# Altium project ppg.PrjPcb
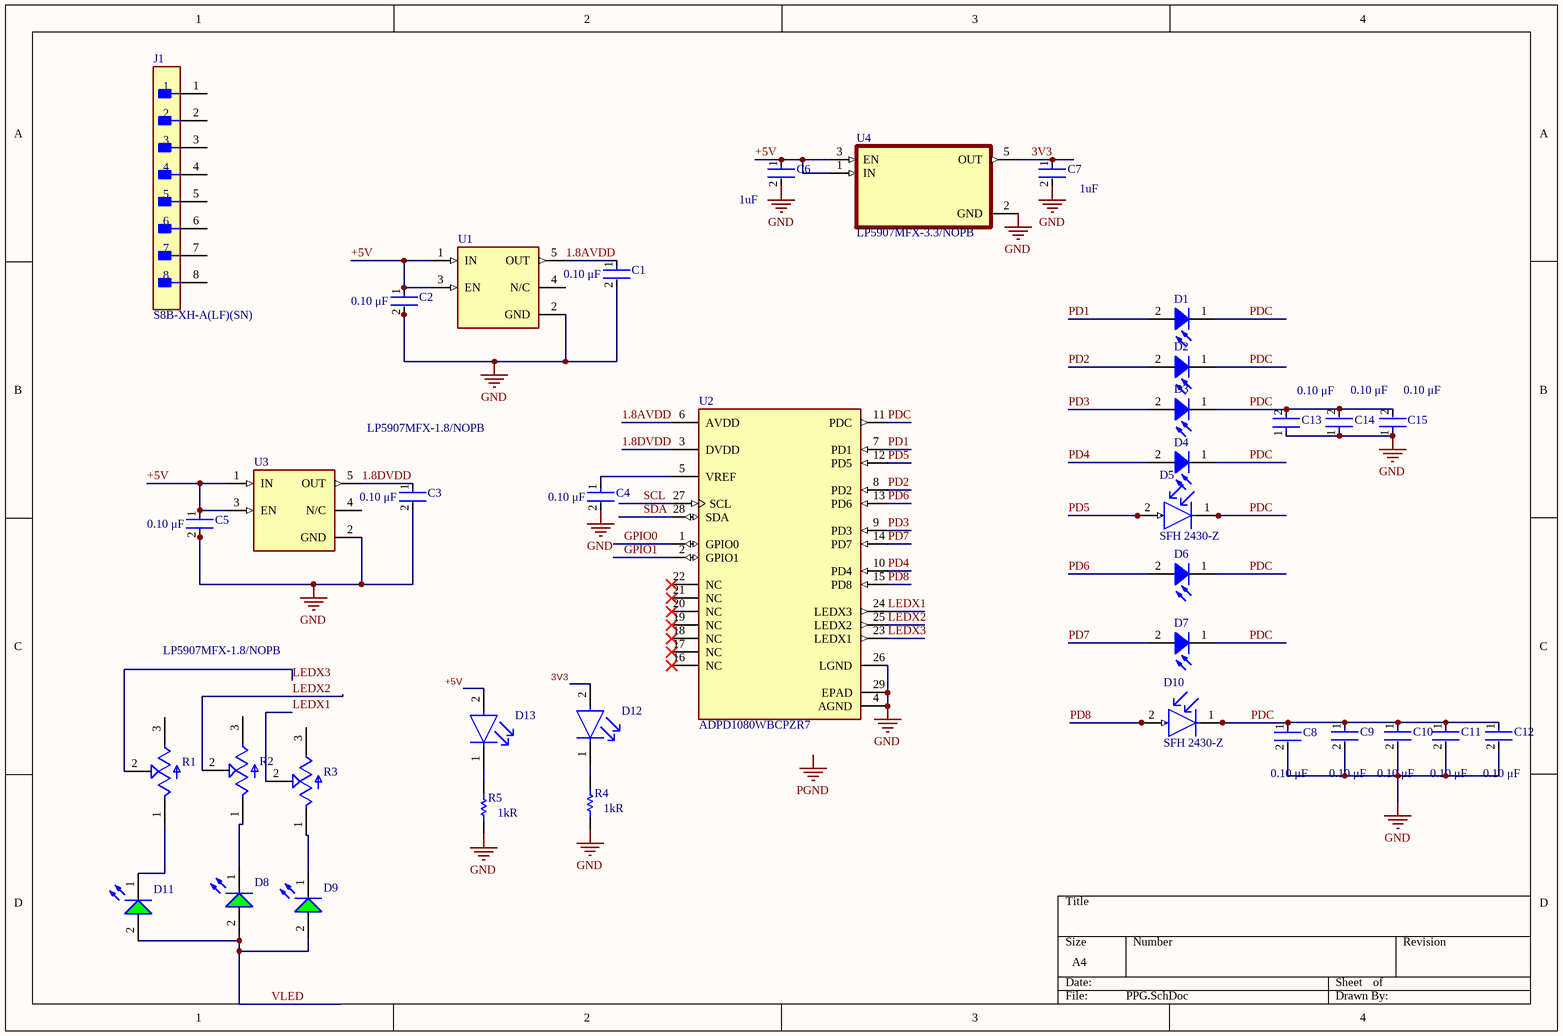
[diagram p0: PPG.SchDoc]
1 sheet, 38 parts. Net scope: global (net labels, ports and power ports of the same name join across sheets).
Board file: PPG.PcbDoc

## Sheet PPG.SchDoc
size A4; SheetNumber: 1; SheetTotal: 1; SPICEModelCacheSGABUIPG: <root> / <DocumentId>SGABUIPG</DocumentId> / <CacheFrame Number="0"> / <Model Name="emk107b7105_a-t" Kind="CKT"> / <Text>* EMK107B7105_A-T     SPICE MODEL  ( General Type ) / *-------------------------------------------------------------------------------------------------------- / * Model Generated by TAIYO YUDEN Corporation (http://www.ty-top.com) / * Version 1.0 / * TAIYO YUDEN Control No. 170508_100817 / * Copyright(c) 2012 TAIYO YUDEN CO.,LTD. All Rights Reserved. / *-------------------------------------------------------------------------------------------------------- / * / * Products Name : Multilayer Ceramic Capacitors / * / * Characteristics : / *     Capacitance : 1 uF , Rated Voltage : 16V , TCC : X7R / *     Case Size : 1.6 x 0.8 / 0.063 x 0.031 [mm/inch] , Thickness : 0.8 / 0.031 [mm/inch] / *     (Conditions: Temperature = 25 degC , DC Bias Current/Voltage = 0A / 0V) / * / * Frequency Range : 40Hz - 3GHz / * / * External Node Assignments : / * / *  1  o---| |---o  2 / * / *-------------------------------------------------------------------------------------------------------- / .SubCkt EMK107B7105_A-T 1 2 / **************************** / C0 1 110 0.90108u / Cm 1 101 0.070545u / C1 101 102 0.18914u / Rc1 101 102 4.3021k / C2 102 103 0.067165u / Rc2 102 103 569.84 / C3 103 110 0.028298u / Rc3 103 110 28.506 / C2m 1 301 0.078621u / C21 301 302 0.41782u / Rc21 301 302 10.613k / C22 302 303 0.38277u / Rc22 302 303 9.5065k / C23 303 304 0.47946u / Rc23 303 304 7.4363k / C24 304 305 0.19696u / Rc24 304 305 877.74 / C25 305 306 0.21015u / Rc25 305 306 755.27 / C26 306 307 0.054853u / Rc26 306 307 98.071 / C27 307 308 0.094721u / Rc27 307 308 50.335 / C28 308 309 0.053445u / Rc28 308 309 88.667 / C29 309 110 951.93p / Rc29 309 110 21.6 / Rp0 1 110 100Meg / L0 110 120 0.31208n / Lm 120 130 0.14711n / L1 120 121 0.11343n / RL1 121 130 0.23291 / L2 120 122 0.12254n / RL2 122 130 0.15461 / L3 120 123 0.22819n / RL3 123 130 0.26571 / CR 120 124 0.16707u / LR 124 125 0.23194n / RR 125 130 39.005m / CL 130 140 2.2074p / LL 130 140 0.16837n / RL 130 140 33.851 / Rs 140 2 5.452m / **************************** / .ends EMK107B7105_A-T</Text> / </Model> / </CacheFrame> / </root>

### Parts
C1  Capacitance: 0.10 μF  [FP-C0402-BB-MFG]  (hidden comment: C0402C104K3RACTU)
C2  Capacitance: 0.10 μF  [FP-C0402-BB-MFG]  (hidden comment: C0402C104K3RACTU)
C3  Capacitance: 0.10 μF  [FP-C0402-BB-MFG]  (hidden comment: C0402C104K3RACTU)
C4  Capacitance: 0.10 μF  [FP-C0402-BB-MFG]  (hidden comment: C0402C104K3RACTU)
C5  Capacitance: 0.10 μF  [FP-C0402-BB-MFG]  (hidden comment: C0402C104K3RACTU)
C6  value 1uF  [FP-0603-L_1_6_0_1-W_0_8_0-IPC_C]  (hidden comment: EMK107B7105KA-T)
C7  value 1uF  [FP-0603-L_1_6_0_1-W_0_8_0-IPC_C]  (hidden comment: EMK107B7105KA-T)
C8  Capacitance: 0.10 μF  [FP-C0402-BB-MFG]  (hidden comment: C0402C104K3RACTU)
C9  Capacitance: 0.10 μF  [FP-C0402-BB-MFG]  (hidden comment: C0402C104K3RACTU)
C10  Capacitance: 0.10 μF  [FP-C0402-BB-MFG]  (hidden comment: C0402C104K3RACTU)
C11  Capacitance: 0.10 μF  [FP-C0402-BB-MFG]  (hidden comment: C0402C104K3RACTU)
C12  Capacitance: 0.10 μF  [FP-C0402-BB-MFG]  (hidden comment: C0402C104K3RACTU)
C13  Capacitance: 0.10 μF  [FP-C0402-BB-MFG]  (hidden comment: C0402C104K3RACTU)
C14  Capacitance: 0.10 μF  [FP-C0402-BB-MFG]  (hidden comment: C0402C104K3RACTU)
C15  Capacitance: 0.10 μF  [FP-C0402-BB-MFG]  (hidden comment: C0402C104K3RACTU)
D1  1541201EEA400  [WL-SDCB_1206]  (value not drawn)
D2  1541201EEA400  [WL-SDCB_1206]  (value not drawn)
D3  1541201EEA400  [WL-SDCB_1206]  (value not drawn)
D4  1541201EEA400  [WL-SDCB_1206]  (value not drawn)
D5  SFH 2430-Z  [FP-SFH_2430-MFG]
D6  1541201EEA400  [WL-SDCB_1206]  (value not drawn)
D7  1541201EEA400  [WL-SDCB_1206]  (value not drawn)
D8  150141GS73100  [WL-SMTW_3528]  (value not drawn)
D9  150141GS73100  [WL-SMTW_3528]  (value not drawn)
D10  SFH 2430-Z  [FP-SFH_2430-MFG]
D11  150141GS73100  [WL-SMTW_3528]  (value not drawn)
D12  LTST-S270KRKT  [FP-LTST-S270KRKT-MFG]  (value not drawn)
D13  LTST-S270KRKT  [FP-LTST-S270KRKT-MFG]  (value not drawn)
J1  S8B-XH-A(LF)(SN)  [S8B-XH-A]
R1  TC33X-2-103E  [TC33X-2-103E]  (value not drawn)
R2  TC33X-2-103E  [TC33X-2-103E]  (value not drawn)
R3  TC33X-2-103E  [TC33X-2-103E]  (value not drawn)
R4  value 1kR  [RESC1005X40X25LL10T10]  (hidden comment: RK73H1ETTP1001F)
R5  value 1kR  [RESC1005X40X25LL10T10]  (hidden comment: RK73H1ETTP1001F)
U1  LP5907MFX-1.8/NOPB  [LP5907MFX-1.8/NOPB]
U2  ADPD1080WBCPZR7  [ADPD1080WBCPZR7]
U3  LP5907MFX-1.8/NOPB  [LP5907MFX-1.8/NOPB]
U4  LP5907MFX-3.3/NOPB  [296-38557-1-ND]

### Nets
GND: C1.2 C2.2 C3.2 C4.2 C5.2 C6.2 C7.2 C8.2 C9.2 C10.2 C11.2 C12.2 C13.1 C14.1 C15.1 R4.1 R5.1 U1.2(GND) U2.4(AGND) U2.26(LGND) U2.29(EPAD) U3.2(GND) U4.2(GND)
1.8AVDD: C1.1 U1.5(OUT) U2.6(AVDD)
1.8DVDD: C3.1 U2.3(DVDD) U3.5(OUT)
3V3: C7.1 D12.2(A) U4.5(OUT)
+5V: C2.1 C5.1 C6.1 D13.2(A) U1.1(IN) U1.3(EN) U3.1(IN) U3.3(EN) U4.1(IN) U4.3(EN)
GPIO0: U2.1(GPIO0)
GPIO1: U2.2(GPIO1)
LEDX1: R3.2(W) U2.24(LEDX3)
LEDX2: R2.2(W) U2.25(LEDX2)
LEDX3: R1.2(W) U2.23(LEDX1)
PD1: D1.2(A) U2.7(PD1)
PD2: D2.2(A) U2.8(PD2)
PD3: D3.2(A) U2.9(PD3)
PD4: D4.2(A) U2.10(PD4)
PD5: D5.2(A) U2.12(PD5)
PD6: D6.2(A) U2.13(PD6)
PD7: D7.2(A) U2.14(PD7)
PD8: D10.2(A) U2.15(PD8)
PDC: C8.1 C9.1 C10.1 C11.1 C12.1 C13.2 C14.2 C15.2 D1.1(K) D2.1(K) D3.1(K) D4.1(K) D5.1(C) D6.1(K) D7.1(K) D10.1(C) U2.11(PDC)
SCL: U2.27(SCL)
SDA: U2.28(SDA)
VLED: D8.2(A) D9.2(A) D11.2(A)
NetC4_1: C4.1 U2.5(VREF)
NetD8_1: D8.1(K) R2.1(CCW)
NetD9_1: D9.1(K) R3.1(CCW)
NetD11_1: D11.1(K) R1.1(CCW)
NetD12_1: D12.1(C) R4.2
NetD13_1: D13.1(C) R5.2

Not connected (* = marked no-connect by the designer): J1 1 2 3 4 5 6 7 8; R1 3(CW); R2 3(CW); R3 3(CW); U1 4(N/C); U2 16(NC)* 17(NC)* 18(NC)* 19(NC)* 20(NC)* 21(NC)* 22(NC)*; U3 4(N/C)

### Notes on the sheet
- Labels drawn without touching a wire or pin: PGND

### Library data of the parts
C1-C5 C8-C15 = CMP-03020-012858-1: Cap Ceramic 0.1uF 25V X7R 10% Pad SMD 0402 125C T/R; Manufacturer: Kemet; Value: 0.10 μF; Temperature Coefficient: 15%; Tolerance: 0.1; Dielectric Material: 4241ConductorMaterial; Temperature: -55°C to +125°C; Automotive: No; Height: 0.55mm; Package: C0402-BB; Category: Cap; Temperature Range Low: -55°C; Manufacturer Part Number: C0402C104K3RACTU; Device Class L2: Capacitors; Temperature Characteristic: X7R; Lead Free: Yes; Material: Ceramic; Mouser Description: Cap Ceramic 0.1uF 25V X7R 10% Pad SMD 0402 125C T/R; Temperature Range High: +125°C; Digikey Description: Cap Ceramic 0.1uF 25V X7R 10% Pad SMD 0402 125C T/R; Ipc Land Pattern Name: CAPC10050X50; Voltage Rating: 25 V; ComponentLink2URL: https://content.kemet.com/datasheets/KEM_C1002_X7R_SMD.pdf; Device Class L3: Ceramic Capacitors; RoHS: TRUE; Device Class L1: Passive Components; Octopart: https://octopart.com/c0402c104k3ractu-kemet-71105629; ComponentLink2Description: Datasheet; Supplier: Digikey; Supplier Part Number: 399-14148-1-ND; Stock: 453452; Pricing: 1=0.16, 10=0.095, 100=0.0611, 1000=0.04279, 2500=0.03794, 5000=0.0349 (USD); Case/Package: 0402; Pins: 2NUMBER; Case Code (Metric): 1005; Case Code (Imperial): 0402; Min Operating Temperature: -55°C; Max Operating Temperature: 125°C; Dielectric: X7R; Packaging: Cut Tape; Voltage Rating (DC): 25V; Reach SVHC Compliant: No; RoHS Compliant: Yes; ComponentLink1URL: http://www.farnell.com/datasheets/2746129.pdf?src-supplier=Farnell; ComponentLink1Description: http://www.farnell.com/datasheets/2746129.pdf?src-supplier=Farnell; ComponentLink3URL: http://www.farnell.com/datasheets/2746129.pdf?src-supplier=Newark; ComponentLink3Description: http://www.farnell.com/datasheets/2746129.pdf?src-supplier=Newark; ComponentLink4URL: http://www.farnell.com/datasheets/2746129.pdf?src-supplier=Element14; ComponentLink4Description: http://www.farnell.com/datasheets/2746129.pdf?src-supplier=Element14; ComponentLink5URL: https://datasheet.octopart.com/C0402C104K3RACTU-Kemet-datasheet-62095741.pdf?src-supplier=Element14; ComponentLink5Description: https://datasheet.octopart.com/C0402C104K3RACTU-Kemet-datasheet-62095741.pdf?src-supplier=Element14; ComponentLink6URL: https://api.kemet.com/component-edge/download/datasheet/C0402C104K3RAC7867.pdf?src-supplier=Digikey; ComponentLink6Description: https://api.kemet.com/component-edge/download/datasheet/C0402C104K3RAC7867.pdf?src-supplier=Digikey; ComponentLink7URL: https://datasheet.octopart.com/C0402C104K3RACTU-KEMET-datasheet-176289272.pdf?src-supplier=Newark; ComponentLink7Description: https://datasheet.octopart.com/C0402C104K3RACTU-KEMET-datasheet-176289272.pdf?src-supplier=Newark; ComponentLink8URL: https://datasheet.octopart.com/C0402C104K3RACTU-KEMET-datasheet-157246124.pdf?src-supplier=Electro+Sonic; ComponentLink8Description: https://datasheet.octopart.com/C0402C104K3RACTU-KEMET-datasheet-157246124.pdf?src-supplier=Electro+Sonic
C6 C7 = CMP-14477-000018-3: None; Manufacturer: Taiyo Yuden; Voltage Rating (DC): 16V; Dielectric: X7R; Tolerance: 10%; Material: 4241ConductorMaterial; Halogen Free: Halogen Free; Height: 0.8mm; REACH SVHC: No SVHC; Contact Plating: Nickel; Number of Pins: 2; Resistor Type: Ceramic; Series: M; Thickness: 0.035inch; Construction: Flat; Voltage Rating: 16V; Capacitance: 1uF; Packaging: Tape and Reel; Width: 0.031inch; Length: 1.6mm; Case Code (Metric): 1608; RoHS Compliant: Yes; Termination: SMD/SMT; Min Operating Temperature: -55°C; Case/Package: 0603; Mount: Surface Mount; Case Code (Imperial): 0603; Depth: 0.8mm; Package Quantity: 1; Max Operating Temperature: 125°C; Lead Free: Lead Free; Radiation Hardening: No; Supplier: Digikey; Supplier Part Number: 587-1241-1-ND; Manufacturer Part Number: EMK107B7105KA-T; RoHS: Yes; Category: Ceramic Capacitors; Stock: 1580663; Pricing: 1=0.08, 10=0.027, 50=0.022, 100=0.0168, 500=0.0152, 1000=0.0136 (USD); Mounting Technology: Surface Mount; Pins: 2; Reach SVHC Compliant: No; ComponentLink1URL: https://datasheet.ciiva.com/5815/1697718-5815968.pdf?src-supplier=Farnell; ComponentLink1Description: https://datasheet.ciiva.com/5815/1697718-5815968.pdf?src-supplier=Farnell; ComponentLink2URL: https://datasheet.ciiva.com/30212/193emk107b7105ka-t-30212019.pdf?src-supplier=Onlinecomponents.com; ComponentLink2Description: https://datasheet.ciiva.com/30212/193emk107b7105ka-t-30212019.pdf?src-supplier=Onlinecomponents.com; ComponentLink3URL: https://datasheet.ciiva.com/15920/966emk107b7105ka-t-15920470.pdf?src-supplier=Onlinecomponents.com; ComponentLink3Description: https://datasheet.ciiva.com/15920/966emk107b7105ka-t-15920470.pdf?src-supplier=Onlinecomponents.com; ComponentLink4URL: https://datasheet.ciiva.com/30137/126emk107b7105ka-t-30137199.pdf?src-supplier=Onlinecomponents.com; ComponentLink4Description: https://datasheet.ciiva.com/30137/126emk107b7105ka-t-30137199.pdf?src-supplier=Onlinecomponents.com; ComponentLink5URL: https://datasheet.ciiva.com/132/emk107b7105ka-t-ss-132544.pdf?src-supplier=Digikey; ComponentLink5Description: https://datasheet.ciiva.com/132/emk107b7105ka-t-ss-132544.pdf?src-supplier=Digikey; ComponentLink6URL: https://datasheet.ciiva.com/26871/getdatasheetpartid-637486-26871306.pdf?src-supplier=Verical; ComponentLink6Description: https://datasheet.ciiva.com/26871/getdatasheetpartid-637486-26871306.pdf?src-supplier=Verical; ComponentLink7URL: https://datasheet.ciiva.com/7657/1697718-7657322.pdf?src-supplier=Element14; ComponentLink7Description: https://datasheet.ciiva.com/7657/1697718-7657322.pdf?src-supplier=Element14; ComponentLink8URL: https://datasheet.ciiva.com/7975/746258-7975612.pdf?src-supplier=Element14; ComponentLink8Description: https://datasheet.ciiva.com/7975/746258-7975612.pdf?src-supplier=Element14
D1-D4 D6 D7 = CMP-03913-98687787-1: 1541201EEA400 WL-SDCB SMT Photodiode Chip Black; Manufacturer: Wurth Electronics; Max Reverse Voltage (DC): 32V; Viewing Angle: 140°; Height: 1.1mm; Width: 1.6mm; Length: 3.2mm; Min Operating Temperature: -40°C; RoHS: Compliant; Max Operating Temperature: 85°C; NexarPartId: 98687787; Supplier: Digikey; Supplier Part Number: 732-13405-1-ND; Manufacturer Part Number: 1541201EEA400; Category: Uncategorized; Stock: 2294; Pricing: 1=0.54, 10=0.463, 50=0.4068, 250=0.36452, 500=0.3276 (USD); ComponentLink1URL: https://www.we-online.com/catalog/datasheet/1541201EEA400.pdf?src-supplier=Digikey; ComponentLink1Description: https://www.we-online.com/catalog/datasheet/1541201EEA400.pdf?src-supplier=Digikey
D5 D10 = CMP-62027-000004-1: SENSOR PHOTODIODE 570NM 2SMD GW; Response Time: 200us; Max Power Dissipation: 150mW; Forward Voltage: 1.2V; Viewing Angle: 120°; Dark Current: 100pA; Reverse Voltage (DC): 6V; Diode Type: PIN; Forward Current: 100mA; Case/Package: SMD/SMT; Width: 4mm; Min Operating Temperature: -40°C; Mount: Surface Mount; Package Quantity: 1500; Packaging: Tape and Reel; Radiation Hardening: No; Wavelength: 570nm; Max Operating Temperature: 100°C; Fall Time: 200us; Length: 4.5mm; Rise Time: 200us; Height: 1.2mm; Max Reverse Voltage (DC): 6V; Number of Pins: 2
D8 D9 D11 = CMP-1429-00004-2: NexarPartId: 29717794; Manufacturer: Wurth Electronics; Forward Current: 100mA; Lens Style: Clear, Round; Color: Green; Wavelength: 525nm; Peak Wavelength: 515nm; Luminous Intensity: 1cd; Forward Voltage: 3.1V; Viewing Angle: 120°; Test Current: 20mA; Max Reverse Voltage (DC): 5V; Power Dissipation: 105mW; Lens Color: Colorless; Lens Transparency: Clear; Lens Size: 2.4mm; Mount: Surface Mount; Max Operating Temperature: 85°C; Min Operating Temperature: -40°C; Lead Free: Lead Free; Width: 2.8mm; Case Code (Imperial): 1411; REACH SVHC: Unknown; RoHS: Compliant; Packaging: Tape and Reel; Length: 3.5mm; Dominant Wavelength: 525nm; Height: 1.9mm; Case/Package: 3528; Reverse Voltage: 5V; Case Code (Metric): 3528; Supplier: Digikey; Supplier Part Number: 732-4997-1-ND; Manufacturer Part Number: 150141GS73100; Category: LEDs; Stock: 36143; Pricing: 1=0.17, 50=0.1684, 100=0.1467, 500=0.115 (USD); Mounting Technology: Surface Mount; Package Quantity: 1; Series: WL-SMTW; RoHS Compliant: Yes; Reach SVHC Compliant: Unknown; ComponentLink1URL: https://datasheet.ciiva.com/23843/150141gs73100-23843266.pdf?src-supplier=Newark; ComponentLink1Description: https://datasheet.ciiva.com/23843/150141gs73100-23843266.pdf?src-supplier=Newark; ComponentLink2URL: https://datasheet.ciiva.com/29278/759463-da-01-en-smd-topled-einf-gruen-150141gs73100-29278953.pdf?src-supplier=Conrad; ComponentLink2Description: https://datasheet.ciiva.com/29278/759463-da-01-en-smd-topled-einf-gruen-150141gs73100-29278953.pdf?src-supplier=Conrad; ComponentLink3URL: https://datasheet.ciiva.com/22656/1911484-22656997.pdf?src-supplier=Element14; ComponentLink3Description: https://datasheet.ciiva.com/22656/1911484-22656997.pdf?src-supplier=Element14; ComponentLink4URL: https://datasheet.ciiva.com/48430/150141gs73100-eng-tds-48430060.pdf?src-supplier=Distrelec; ComponentLink4Description: https://datasheet.ciiva.com/48430/150141gs73100-eng-tds-48430060.pdf?src-supplier=Distrelec; ComponentLink5URL: https://datasheet.ciiva.com/29563/150141gs73100-29563029.pdf?src-supplier=Digikey; ComponentLink5Description: https://datasheet.ciiva.com/29563/150141gs73100-29563029.pdf?src-supplier=Digikey; ComponentLink6URL: https://datasheet.ciiva.com/29563/150141gs73100-29563030.pdf?src-supplier=Digikey; ComponentLink6Description: https://datasheet.ciiva.com/29563/150141gs73100-29563030.pdf?src-supplier=Digikey
D12 D13 = CMP-2000-06630-2: LED RED CLEAR CHIP SMD R/A; Manufacturer: Vishay Lite-On; Test Current: 20mA; Number of LEDs: 1; Power Rating: 75mW; Lens Style: Diffused; Luminous Intensity: 54mcd; Wavelength: 639nm; Dominant Wavelength: 631nm; Lens Color: Colorless; Forward Voltage: 2V; Viewing Angle: 130°; Forward Current: 30mA; Reverse Voltage: 5V; Lens Size: 0.6mm; Illumination Color: Red; Case Code (Imperial): 0603; Color: Red; Packaging: Tape and Reel; Number of Pins: 2; Length: 1.6mm; Lens Transparency: Clear; Width: 1.15mm; Power Dissipation: 75mW; Lead Free: Lead Free; Max Power Dissipation: 75mW; Case/Package: 0603; Max Operating Temperature: 85°C; Mount: Surface Mount; Depth: 0.6mm; Number of Elements: 1; Radiation Hardening: No; Case Code (Metric): 1608; Package Quantity: 1; Height: 0.6mm; Min Operating Temperature: -55°C; Supplier: Digikey; Supplier Part Number: 160-1479-1-ND; Manufacturer Part Number: LTST-S270KRKT; RoHS: Yes; Category: LEDs; Stock: 83540; Pricing: 1=0.24, 10=0.133, 100=0.0617, 500=0.05696, 1000=0.04462, 2000=0.04367 (USD); Mounting Technology: Surface Mount; Pins: 2; Series: -; RoHS Compliant: Yes; ComponentLink1URL: https://datasheet.ciiva.com/11775/0900766b80dc0b8e-11775445.pdf?src-supplier=Rs; ComponentLink1Description: https://datasheet.ciiva.com/11775/0900766b80dc0b8e-11775445.pdf?src-supplier=Rs; ComponentLink2URL: https://datasheet.ciiva.com/12400/ltst-s270krkt-201849-12400833.pdf?src-supplier=Mouser; ComponentLink2Description: https://datasheet.ciiva.com/12400/ltst-s270krkt-201849-12400833.pdf?src-supplier=Mouser; ComponentLink3URL: https://datasheet.ciiva.com/2110/ltst-s270krkt-2110021.pdf?src-supplier=Digikey; ComponentLink3Description: https://datasheet.ciiva.com/2110/ltst-s270krkt-2110021.pdf?src-supplier=Digikey; ComponentLink4URL: https://datasheet.ciiva.com/16387/p-100-ltst-s270krkt-16387507.pdf?src-supplier=Future+Electronics; ComponentLink4Description: https://datasheet.ciiva.com/16387/p-100-ltst-s270krkt-16387507.pdf?src-supplier=Future+Electronics; ComponentLink5URL: https://datasheet.ciiva.com/2110/s-110-ltst-s270krkt-2110023.pdf?src-supplier=Digikey; ComponentLink5Description: https://datasheet.ciiva.com/2110/s-110-ltst-s270krkt-2110023.pdf?src-supplier=Digikey; ComponentLink6URL: https://datasheet.ciiva.com/2110/s-110-ltst-s270krkt-2110022.pdf?src-supplier=Digikey; ComponentLink6Description: https://datasheet.ciiva.com/2110/s-110-ltst-s270krkt-2110022.pdf?src-supplier=Digikey
J1 = S8B-XH-A(LF)(SN): Conn Shrouded Header (4 Sides) HDR 8 POS 2.5mm Solder RA Thru-Hole Box; Manufacturer: JST; Current Rating: 3A; Voltage Rating: 250V; Number of Positions: 8; Contact Resistance: 20mR; Supplier: Mouser; Supplier Part Number: 306-S8B-XH-ALFSN; Manufacturer Part Number: S8B-XH-A(LF)(SN); RoHS: Yes; Category: Headers and Wire Housings; Stock: 23372; Pricing: 1=0.31, 10=0.278, 50=0.278, 100=0.197, 1000=0.159, 10000=0.159 (USD); Mounting Technology: Through Hole; Contact Material: Brass; Contact Plating: Tin,Copper,Lead; Contact Shape: Square; Insulation Material: Nylon; Insulation Color: Natural; Contact Finish - Mating: TIN; Housing Color: White; Housing Material: Polyamide; Min Operating Temperature: -25°C; Max Operating Temperature: 85°C; Number of Rows: 1; Packaging: Bulk; Termination: Solder; Orientation: Right Angle; Connector Type: Header; Fastening Type: Detent; Series: XH; Contact Type: Male Pin; Max Current Rating: 3A; Number of Contacts: 8; Max Voltage Rating (AC): 250V; Length: 22.4mm; Pitch: 2.5mm; Depth: 11.5mm; Flammability Rating: UL94 V-0; Reach SVHC Compliant: No; ComponentLink1URL: https://datasheet.ciiva.com/26894/getdatasheetpartid-748678-26894649.pdf?src-supplier=Verical; ComponentLink1Description: https://datasheet.ciiva.com/26894/getdatasheetpartid-748678-26894649.pdf?src-supplier=Verical; ComponentLink2URL: https://datasheet.ciiva.com/726/exh-726382.pdf?src-supplier=Digikey; ComponentLink2Description: https://datasheet.ciiva.com/726/exh-726382.pdf?src-supplier=Digikey; ComponentLink3URL: https://datasheet.ciiva.com/16484/exh-16484633.pdf?src-supplier=Future+Electronics; ComponentLink3Description: https://datasheet.ciiva.com/16484/exh-16484633.pdf?src-supplier=Future+Electronics; Supplier 1: Mouser; Supplier Part Number 1: 306-S8B-XH-ALFSN
R1-R3 = TC33X-2-103E: Cermet trimmer potentiometer, 10 kΩ, 0.1 W, SMD, on top, TC33X-2-103E; Manufacturer: Bourns; Tolerance: 25%; Value: 10kR; Number of Turns: 1; Power Rating: 100mW; Temperature Coefficient: 250ppm/°C; Voltage Rating (DC): 50V; Supplier: Digikey; Supplier Part Number: TC33X-103ECT-ND; Manufacturer Part Number: TC33X-2-103E; RoHS: Yes; Category: Variable Resistors and Potentiometers; Stock: 58293; Pricing: 1=0.33, 10=0.267, 25=0.2448, 50=0.2292, 100=0.2147, 250=0.19668, 500=0.18402, 1000=0.17215 (USD); Mounting Technology: Surface Mount; Color: Silver; Weight: 29.4mg; Min Operating Temperature: -40°C; Max Operating Temperature: 100°C; Packaging: Tape and Reel; Package Quantity: 1; Resistor Type: Cermet; Termination: Foot Print; Taper: Linear; Max Power Dissipation: 100mW; Series: TC33; Resistance Tolerance: 25%; Length: 3mm; Width: 0.118inch; Height: 0.047inch; Depth: 3.8mm; Radiation Hardening: No; Reach SVHC Compliant: No; Military Standard: Not; Lead Free: Lead Free; RoHS Compliant: Yes; ComponentLink1URL: https://datasheet.ciiva.com/11830/0900766b802749b3-11830705.pdf?src-supplier=Rs; ComponentLink1Description: https://datasheet.ciiva.com/11830/0900766b802749b3-11830705.pdf?src-supplier=Rs; ComponentLink2URL: https://datasheet.ciiva.com/7953/1818686-7953349.pdf?src-supplier=Element14; ComponentLink2Description: https://datasheet.ciiva.com/7953/1818686-7953349.pdf?src-supplier=Element14; ComponentLink3URL: https://datasheet.ciiva.com/28659/1520225-28659212.pdf?src-supplier=Element14; ComponentLink3Description: https://datasheet.ciiva.com/28659/1520225-28659212.pdf?src-supplier=Element14; ComponentLink4URL: https://datasheet.ciiva.com/2155/tc33-2155963.pdf?src-supplier=Digikey; ComponentLink4Description: https://datasheet.ciiva.com/2155/tc33-2155963.pdf?src-supplier=Digikey; ComponentLink5URL: https://datasheet.ciiva.com/2155/tc33-2155964.pdf?src-supplier=Digikey; ComponentLink5Description: https://datasheet.ciiva.com/2155/tc33-2155964.pdf?src-supplier=Digikey; ComponentLink6URL: https://datasheet.ciiva.com/2155/tc33-2155962.pdf?src-supplier=Digikey; ComponentLink6Description: https://datasheet.ciiva.com/2155/tc33-2155962.pdf?src-supplier=Digikey; ComponentLink7URL: https://datasheet.ciiva.com/8089/tc33-8089484.pdf?src-supplier=Avnet; ComponentLink7Description: https://datasheet.ciiva.com/8089/tc33-8089484.pdf?src-supplier=Avnet; ComponentLink8URL: https://datasheet.ciiva.com/26944/getdatasheetpartid-183773-26944166.pdf?src-supplier=Verical; ComponentLink8Description: https://datasheet.ciiva.com/26944/getdatasheetpartid-183773-26944166.pdf?src-supplier=Verical; Supplier 1: Digikey; Supplier Part Number 1: TC33X-103ECT-ND
R4 R5 = CMP-2002-03808-1: Manufacturer: KOA Speer; Tolerance: 1%; Power Rating: 63mW; Voltage Rating: 50V; Temperature Coefficient: 100ppm/°C; Max Power Dissipation: 100mW; Part Number: RK73H1ETTP1001F; Supplier: Digikey; Supplier Part Number: 2019-RK73H1ETTP1001FCT-ND; Manufacturer Part Number: RK73H1ETTP1001F; RoHS: Yes; Category: Chip SMD Resistors; Stock: 1021606; Pricing: 1=0.1, 10=0.021, 50=0.0134, 100=0.0112, 500=0.00764, 1000=0.00658, 5000=0.00478 (USD); Mounting Technology: Surface Mount; Case/Package: 0402; Case Code (Imperial): 0402; Case Code (Metric): 1005; Min Operating Temperature: -55°C; Max Operating Temperature: 155°C; Packaging: Tape and Reel; Package Quantity: 10000; Termination: SMD/SMT; Series: RK73H; Construction: Rectangular; Technology: THICK FILM; Features: Moisture Resistant,Automotive AEC-Q200; Number of Terminations: 2; Voltage Rating (DC): 50V; Length: 1mm; Width: 0.5mm; Height: 0.35mm; Depth: 0.5mm; Ratings: AEC-Q200; Military Standard: Not; RoHS Compliant: Yes; Lead Free: 5697LeadFree; ComponentLink1URL: https://datasheet.ciiva.com/5554/rk73h-5554172.pdf?src-supplier=Mouser; ComponentLink1Description: https://datasheet.ciiva.com/5554/rk73h-5554172.pdf?src-supplier=Mouser
U1 U3 = LP5907MFX-1.8/NOPB: LDO Regulator Pos 1.8V 0.25A 5-Pin SOT-23 T/R; Manufacturer: Texas Instruments; Min Input Voltage: 2.2V; Number of Outputs: 1; Dropout Voltage: 250mV; Max Supply Voltage: 5.5V; Output Current: 250mA; Quiescent Current: 25uA; Power Supply Rejection Ratio (PSRR): 60dB; Output Type: Fixed; Output Configuration: Positive; Max Supply Current: 425uA; Supplier: Mouser; Supplier Part Number: 595-LP5907MFX-1.8NPB; Manufacturer Part Number: LP5907MFX-1.8/NOPB; RoHS: Yes; Category: Voltage Regulators - Linear; Stock: 22864; Pricing: 1=0.45, 10=0.277, 50=0.277, 100=0.229, 1000=0.212, 10000=0.197 (USD); Mounting Technology: Surface Mount; Case/Package: SOT-23-5; Pins: 5; Min Operating Temperature: -40°C; Max Operating Temperature: 125°C; Packaging: Tape and Reel; Package Quantity: 3000; Output Voltage: 1.8V; Number of Regulators: 1; Nominal Output Voltage: 1.8V; Series: -; Min Output Voltage: 1.8V; Reach SVHC Compliant: No; Lead Free: Lead Free; RoHS Compliant: Yes; ComponentLink1URL: https://media.digikey.com/pdf/Data%20Sheets/Texas%20Instruments%20PDFs/ConnectedSensorAutoSystemsGuide.pdf?src-supplier=Digikey; ComponentLink1Description: https://media.digikey.com/pdf/Data%20Sheets/Texas%20Instruments%20PDFs/ConnectedSensorAutoSystemsGuide.pdf?src-supplier=Digikey; ComponentLink2URL: http://www.ti.com/general/docs/lit/getliterature.tsp?genericPartNumber=LP5907&fileType=pdf&src-supplier=Farnell; ComponentLink2Description: http://www.ti.com/general/docs/lit/getliterature.tsp?genericPartNumber=LP5907&fileType=pdf&src-supplier=Farnell; ComponentLink3URL: http://www.ti.com/general/docs/lit/getliterature.tsp?genericPartNumber=LP5907&amp;&amp;fileType=pdf&src-supplier=Element14; ComponentLink3Description: http://www.ti.com/general/docs/lit/getliterature.tsp?genericPartNumber=LP5907&amp;&amp;fileType=pdf&src-supplier=Element14; ComponentLink4URL: http://www.ti.com/lit/pdf/szzy004?src-supplier=Digikey; ComponentLink4Description: http://www.ti.com/lit/pdf/szzy004?src-supplier=Digikey; ComponentLink5URL: http://www.ti.com/lit/gpn/lp5907?src-supplier=Mouser; ComponentLink5Description: http://www.ti.com/lit/gpn/lp5907?src-supplier=Mouser; ComponentLink6URL: http://www.ti.com/general/docs/lit/getliterature.tsp?genericPartNumber=LP5907&&fileType=pdf&src-supplier=Avnet; ComponentLink6Description: http://www.ti.com/general/docs/lit/getliterature.tsp?genericPartNumber=LP5907&&fileType=pdf&src-supplier=Avnet; Supplier 1: Digikey; Supplier Part Number 1: 296-41463-1-ND
U2 = ADPD1080WBCPZR7: Optical Afe For Health Monitorin; Supplier 1: Digikey; Supplier Part Number 1: 505-ADPD1080WBCPZR7CT-ND
U4 = LP5907MFX-3.3/NOPB: 250-mA ultra-low-noise low-IQ low-dropout (LDO) linear regulator 5-SOT-23 -40 to 125; Manufacturer: Texas Instruments; Output Voltage: 3.3V; Number of Outputs: 1; Min Input Voltage: 2.2V; Max Supply Voltage: 5.5V; Max Output current: 250mA; Dropout Voltage: 250mV; Polarity: Positive; Quiescent Current: 25uA; Accuracy: 2%; Power Supply Rejection Ratio (PSRR): 60dB; Output Type: Fixed; Max Supply Current: 425uA; Nominal Supply Current: 12uA; Number of Channels: 1NUMBER; Supplier: Digikey; Supplier Part Number: 296-38557-1-ND; Manufacturer Part Number: LP5907MFX-3.3/NOPB; RoHS: Yes; Category: Voltage Regulators - Linear; Stock: 10289; Pricing: 1=0.45, 10=0.314, 25=0.2804, 100=0.2431, 250=0.22532, 500=0.21458, 1000=0.20576 (USD); Mounting Technology: Surface Mount; Case/Package: SOT-23-5; Pins: 5; Min Operating Temperature: -40°C; Max Operating Temperature: 125°C; Packaging: Tape and Reel; Output Current: 250mA; Package Quantity: 3000; Number of Regulators: 1; Nominal Output Voltage: 3.3V; Series: -; Output Configuration: Positive; Min Supply Voltage: 2.2V; Length: 2.9mm; Width: 1.6mm; Height: 1.45mm; Thickness: 1.2mm; Radiation Hardening: No; Reach SVHC Compliant: No; Lead Free: Lead Free; RoHS Compliant: Yes; ComponentLink1URL: https://datasheet.ciiva.com/48475/lp5907-48475084.pdf?src-supplier=Avnet; ComponentLink1Description: https://datasheet.ciiva.com/48475/lp5907-48475084.pdf?src-supplier=Avnet; Supplier 1: Digikey; Supplier Part Number 1: 296-38557-1-ND